# EAGLE design Mixer (EAGLE 9.2.2)
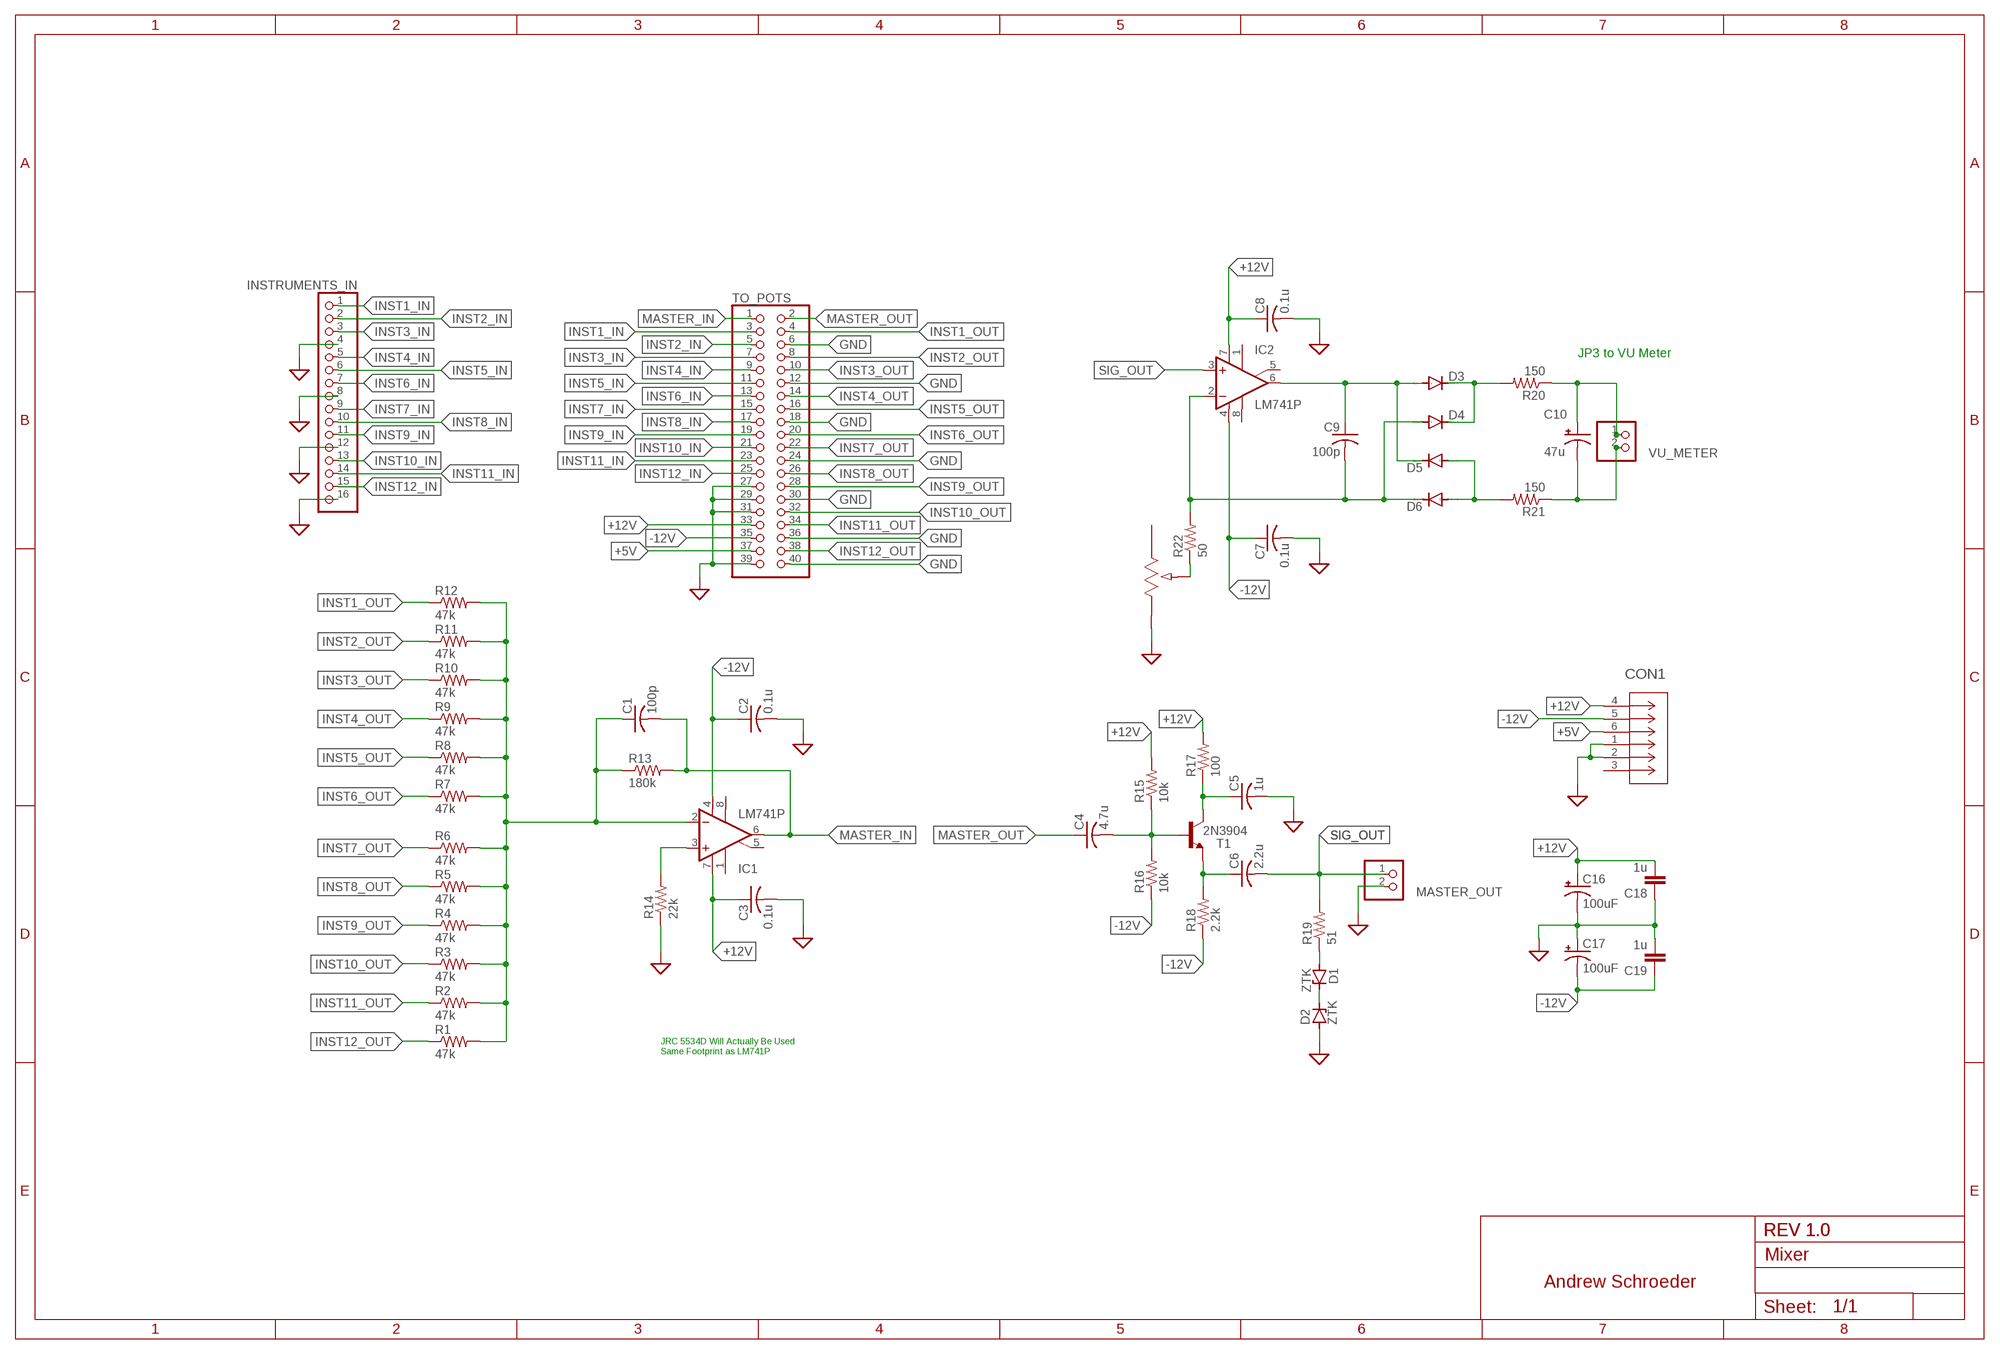
[diagram p0: schematic, sheet 1]

## Parts
C1  100p  C-US025-025X050  [C025-025X050]
C2  0.1u  C-US025-025X050  [C025-025X050]
C3  0.1u  C-US025-025X050  [C025-025X050]
C4  4.7u  C-US025-025X050  [C025-025X050]
C5  1u  C-US025-025X050  [C025-025X050]
C6  2.2u  C-US025-025X050  [C025-025X050]
C7  0.1u  C-US025-025X050  [C025-025X050]
C8  0.1u  C-US025-025X050  [C025-025X050]
C9  100p  C-US025-025X050  [C025-025X050]
C10  47u  CPOL-USE2-5  [E2-5]
C16  100uF  CPOL-USE5-8.5  [E5-8,5]
C17  100uF  CPOL-USE5-8.5  [E5-8,5]
C18  1u  C-EU050-024X044  [C050-024X044]
C19  1u  C-EU050-024X044  [C050-024X044]
CON1  1-770875-01-770875-0_VERTICAL  [1-770875-0]
D1  ZTK  [DO35Z10]
D2  ZTK  [DO35Z10]
D3  1N4148DO35-7  [DO35-7]
D4  1N4148DO35-7  [DO35-7]
D5  1N4148DO35-7  [DO35-7]
D6  1N4148DO35-7  [DO35-7]
IC1  LM741P  [DIL08]
IC2  LM741P  [DIL08]
INSTRUMENTS_IN  PINHD-1X16  [1X16]
MASTER_OUT  PINHD-1X2  [1X02]
R1  47k  R-US_0207/7  [0207/7]
R2  47k  R-US_0207/7  [0207/7]
R3  47k  R-US_0207/7  [0207/7]
R4  47k  R-US_0207/7  [0207/7]
R5  47k  R-US_0207/7  [0207/7]
R6  47k  R-US_0207/7  [0207/7]
R7  47k  R-US_0207/7  [0207/7]
R8  47k  R-US_0207/7  [0207/7]
R9  47k  R-US_0207/7  [0207/7]
R10  47k  R-US_0207/7  [0207/7]
R11  47k  R-US_0207/7  [0207/7]
R12  47k  R-US_0207/7  [0207/7]
R13  180k  R-US_0207/7  [0207/7]
R14  22k  R-US_0207/7  [0207/7]
R15  10k  R-US_0207/7  [0207/7]
R16  10k  R-US_0207/7  [0207/7]
R17  100  R-US_0207/7  [0207/7]
R18  2.2k  R-US_0207/7  [0207/7]
R19  51  R-US_0207/7  [0207/7]
R20  150  R-US_0207/7  [0207/7]
R21  150  R-US_0207/7  [0207/7]
R22  50  R-US_0207/7  [0207/7]
R23  PV36W101C01B00  [POT_PV36W]
T1  2N3904  [TO92]
TO_POTS  PINHD-2X20  [2X20]
VU_METER  PINHD-1X2  [1X02]

## Nets
+5V: CON1.6 TO_POTS.37
+12V: C3.1 C8.1 C16.+ C18.2 CON1.4 IC1.7(V+) IC2.7(V+) R15.2 R17.2 TO_POTS.33
-12V: C2.1 C7.1 C17.- C19.1 CON1.5 IC1.4(V-) IC2.4(V-) R16.1 R18.1 TO_POTS.35
GND: C2.2 C3.2 C5.2 C7.2 C8.2 C16.- C17.+ C18.1 C19.2 CON1.1 CON1.2 D2.A INSTRUMENTS_IN.4 INSTRUMENTS_IN.8 INSTRUMENTS_IN.12 INSTRUMENTS_IN.16 MASTER_OUT.2 R14.1 R23.3 TO_POTS.6 TO_POTS.12 TO_POTS.18 TO_POTS.24 TO_POTS.27 TO_POTS.29 TO_POTS.30 TO_POTS.31 TO_POTS.36 TO_POTS.39 TO_POTS.40 ; supply symbol labelled SUP
INST1_IN: INSTRUMENTS_IN.1 TO_POTS.3
INST1_OUT: R12.1 TO_POTS.4
INST2_IN: INSTRUMENTS_IN.2 TO_POTS.5
INST2_OUT: R11.1 TO_POTS.8
INST3_IN: INSTRUMENTS_IN.3 TO_POTS.7
INST3_OUT: R10.1 TO_POTS.10
INST4_IN: INSTRUMENTS_IN.5 TO_POTS.9
INST4_OUT: R9.1 TO_POTS.14
INST5_IN: INSTRUMENTS_IN.6 TO_POTS.11
INST5_OUT: R8.1 TO_POTS.16
INST6_IN: INSTRUMENTS_IN.7 TO_POTS.13
INST6_OUT: R7.1 TO_POTS.20
INST7_IN: INSTRUMENTS_IN.9 TO_POTS.15
INST7_OUT: R6.1 TO_POTS.22
INST8_IN: INSTRUMENTS_IN.10 TO_POTS.17
INST8_OUT: R5.1 TO_POTS.26
INST9_IN: INSTRUMENTS_IN.11 TO_POTS.19
INST9_OUT: R4.1 TO_POTS.28
INST10_IN: INSTRUMENTS_IN.13 TO_POTS.21
INST10_OUT: R3.1 TO_POTS.32
INST11_IN: INSTRUMENTS_IN.14 TO_POTS.23
INST11_OUT: R2.1 TO_POTS.34
INST12_IN: INSTRUMENTS_IN.15 TO_POTS.25
INST12_OUT: R1.1 TO_POTS.38
MASTER_IN: C1.2 IC1.6(OUT) R13.2 TO_POTS.1
MASTER_OUT: C4.1 TO_POTS.2
N$1: C9.1 D3.A D5.C IC2.6(OUT)
N$2: IC1.3(+IN) R14.2
N$3: C9.2 D4.A D6.C IC2.2(-IN) R22.2
N$4: C1.1 IC1.2(-IN) R1.2 R2.2 R3.2 R4.2 R5.2 R6.2 R7.2 R8.2 R9.2 R10.2 R11.2 R12.2 R13.1
N$5: D5.A D6.A R21.2
N$6: C4.2 R15.1 R16.2 T1.2(B)
N$7: C10.+ R20.1 VU_METER.1
N$8: C5.1 R17.1 T1.1(C)
N$9: D3.C D4.C R20.2
N$10: C6.1 R18.2 T1.3(E)
N$11: C10.- R21.1 VU_METER.2
N$12: D1.A R19.1
N$13: R22.1 R23.2
N$16: D1.C D2.C
SIG_OUT: C6.2 IC2.3(+IN) MASTER_OUT.1 R19.2
Unconnected: CON1.3 IC1.1(ON1) IC1.5(ON2) IC1.8(OPT) IC2.1(ON1) IC2.5(ON2) IC2.8(OPT) R23.1

## Notes on the sheet
- JP3 to VU Meter
- JRC 5534D Will Actually Be Used
  Same Footprint as LM741P
- REV 1.0 | REV 1.0
- Andrew Schroeder

## Library data of the parts
C1-C9 = rcl:C-US: CAPACITOR, American symbol; SPICEPREFIX: C
C10 C16 C17 = rcl:CPOL-US: POLARIZED CAPACITOR, American symbol; SPICEPREFIX: C
C18 C19 = resistor:C-EU: CAPACITOR, European symbol
CON1 = Capstone:1-770875-0
D1 D2 = diode:ZTK: Z DIODE
D3-D6 = diode:1N4148: DIODE high speed (Philips)
IC1 IC2 = linear:*741: OP AMP
INSTRUMENTS_IN = pinhead:PINHD-1X16: PIN HEADER
MASTER_OUT VU_METER = pinhead:PINHD-1X2: PIN HEADER
R1-R22 = rcl:R-US_: RESISTOR, American symbol; SPICEPREFIX: R
R23 = Capstone:PV36W101C01B00; MANUFACTURER_PART_NUMBER: PV36W101C01B00; VENDOR: Murata
T1 = transistor:2N3904: NPN TRANSISTOR
TO_POTS = pinhead:PINHD-2X20: PIN HEADER

## Board
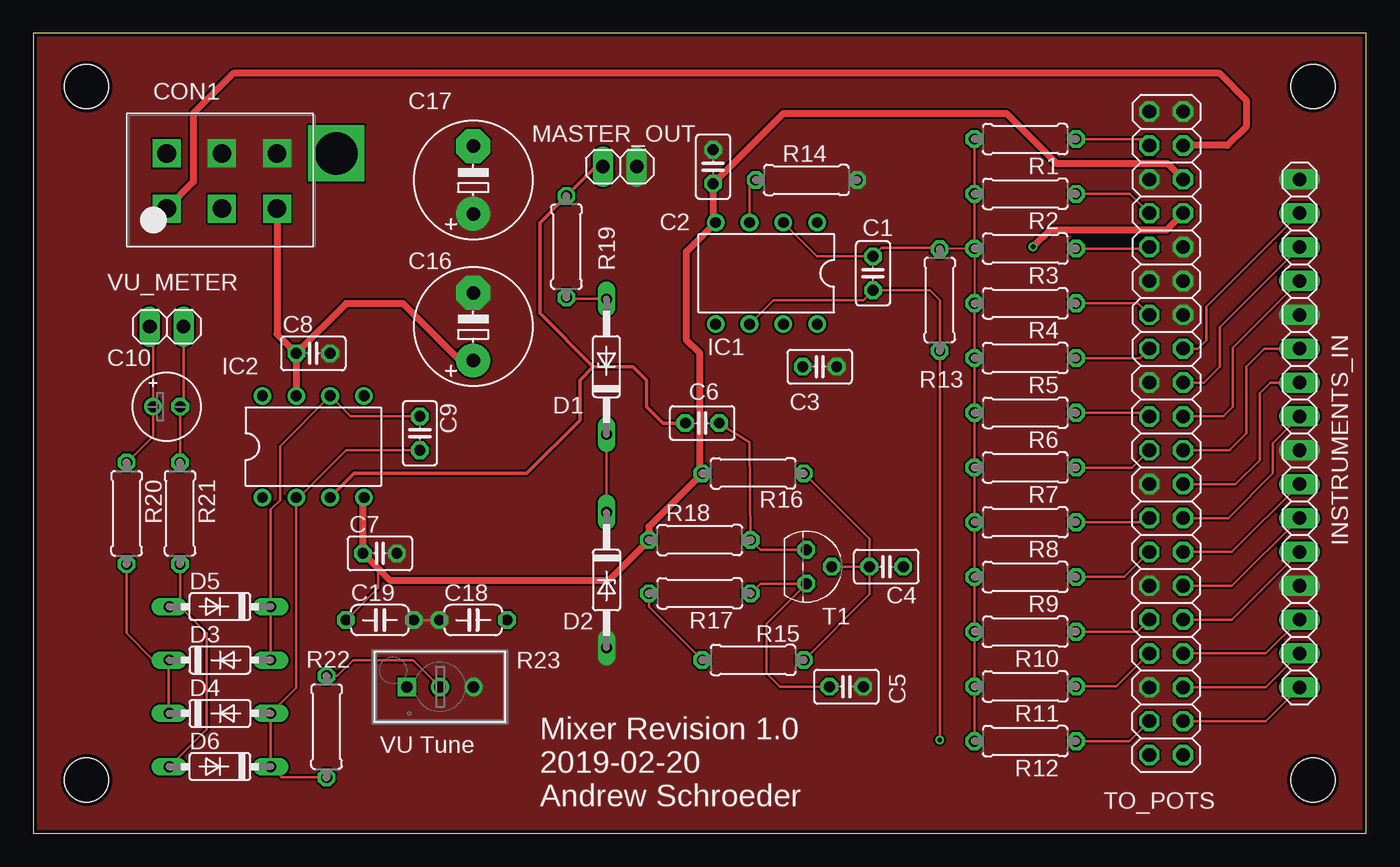
[diagram p1: board, top side]
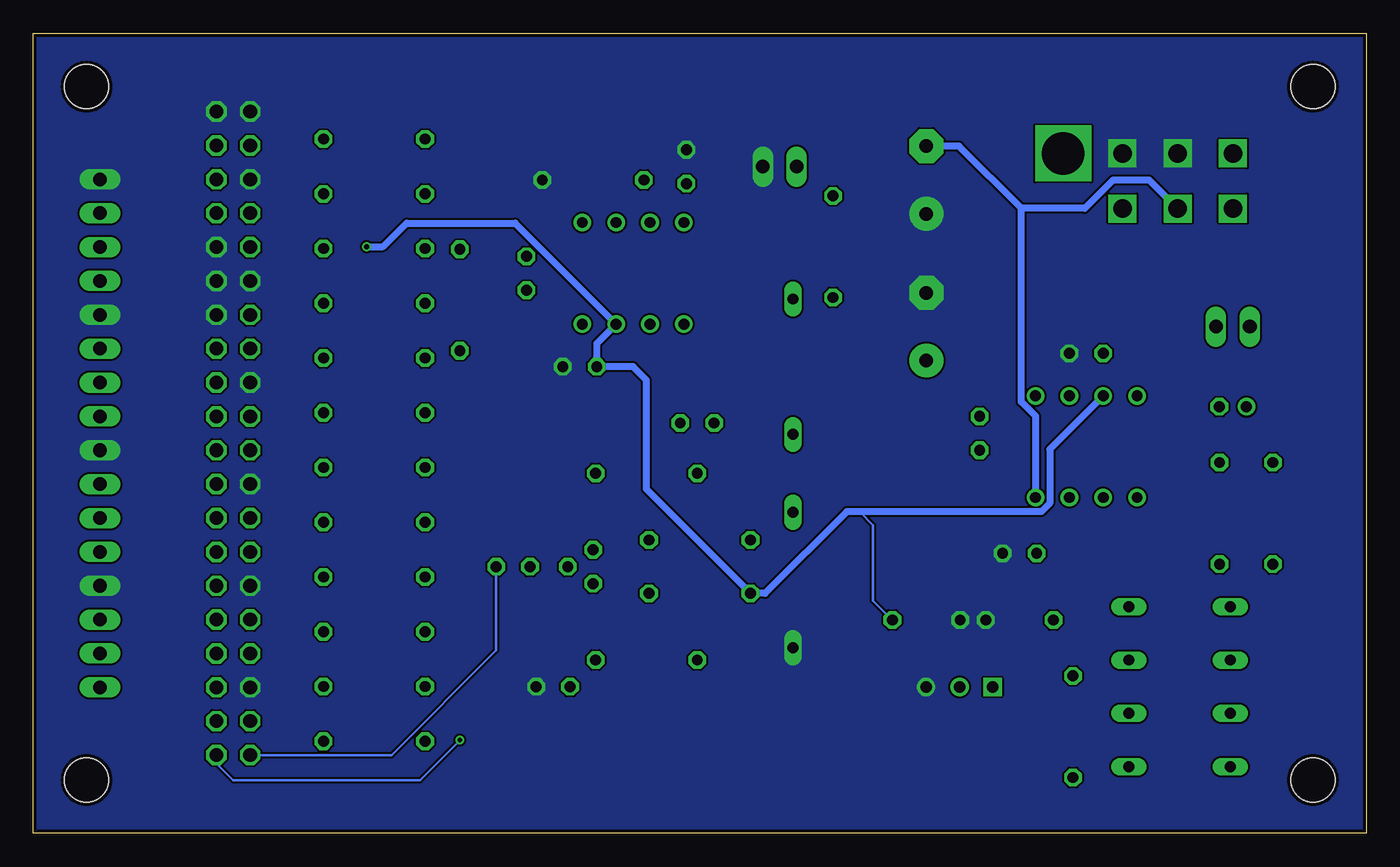
[diagram p2: board, bottom side, seen from below]

Size 100 x 60 mm. Coordinates in mm from the lower left corner, seen from the top.
Outline: 0,0 100,0 100,60 0,60 0,0
Copper layers (1*16): Top 0.035mm / dielectric 1.5mm / Bottom 0.035mm
Design rules "SeeedStudio_2layer_DRU_no_angle_20140221": minimum track width 6mil, minimum drill 12mil, track to track 6mil, track to pad 6mil, pad to pad 6mil, via to via 6mil, smd to smd 0mil, copper to edge 10mil, drill to drill 10mil, minimum pad ring 10mil, minimum via ring 6mil, stop-mask expansion 2mil, vias tented up to drill 100mil, thermal gap 10mil

### Footprints (pad centres in the part's own frame; a part is rotated, then mirrored left to right if it is on the bottom)
C025-025X050 = drill 0.813 octagon: 1 -1.27,0; 2 1.27,0
E2-5 = drill 0.813 pad 1.27: + -1.016,0 | drill 0.813 pad 1.27 octagon: - 1.016,0
E5-8,5 = drill 1.016 pad 2.54: + -2.54,0 | drill 1.016 pad 2.54 octagon: - 2.54,0
C050-024X044 = drill 0.813 octagon: 1 -2.54,0; 2 2.54,0
1-770875-0 = drill 1.4 square: 1 8.28,0; 2 4.14,0; 3 0,0; 4 8.28,-4.14; 5 4.14,-4.14; 6 0,-4.14 | drill 3.18 square: NULL 12.73,0
DO35Z10 = drill 0.813 long: A 5.08,0; C -5.08,0
DO35-7 = drill 0.813 long: A 3.81,0; C -3.81,0
DIL08 = drill 0.813 pad 1.27: 1 -3.81,-3.81; 2 -1.27,-3.81; 3 1.27,-3.81; 4 3.81,-3.81; 5 3.81,3.81; 6 1.27,3.81; 7 -1.27,3.81; 8 -3.81,3.81
1X16 = drill 1.016 long: 1 -19.05,0; 2 -16.51,0; 3 -13.97,0; 4 -11.43,0; 5 -8.89,0; 6 -6.35,0; 7 -3.81,0; 8 -1.27,0; 9 1.27,0; 10 3.81,0; 11 6.35,0; 12 8.89,0; 13 11.43,0; 14 13.97,0; 15 16.51,0; 16 19.05,0
1X02 = drill 1.016 long: 1 -1.27,0; 2 1.27,0
0207/7 = drill 0.813 octagon: 1 -3.81,0; 2 3.81,0
POT_PV36W = drill 0.864 pad 1.372 square: 1 -4.978,-0.025 | drill 0.864 pad 1.372: 2 -2.489,-0.025; 3 0.025,-0.025
TO92 = drill 0.813 octagon: 1 1.27,0; 2 0,1.905; 3 -1.27,0
2X20 = drill 1.016 octagon: 1 -24.13,-1.27; 2 -24.13,1.27; 3 -21.59,-1.27; 4 -21.59,1.27; 5 -19.05,-1.27; 6 -19.05,1.27; 7 -16.51,-1.27; 8 -16.51,1.27; 9 -13.97,-1.27; 10 -13.97,1.27; 11 -11.43,-1.27; 12 -11.43,1.27; 13 -8.89,-1.27; 14 -8.89,1.27; 15 -6.35,-1.27; 16 -6.35,1.27; 17 -3.81,-1.27; 18 -3.81,1.27; 19 -1.27,-1.27; 20 -1.27,1.27; 21 1.27,-1.27; 22 1.27,1.27; 23 3.81,-1.27; 24 3.81,1.27; 25 6.35,-1.27; 26 6.35,1.27; 27 8.89,-1.27; 28 8.89,1.27; 29 11.43,-1.27; 30 11.43,1.27; 31 13.97,-1.27; 32 13.97,1.27; 33 16.51,-1.27; 34 16.51,1.27; 35 19.05,-1.27; 36 19.05,1.27; 37 21.59,-1.27; 38 21.59,1.27; 39 24.13,-1.27; 40 24.13,1.27
STAND-OFF = hole 3.302: 0,0

### Placement (x,y rotation side)
C1  63,42 270 top
C2  51,50 90 top
C3  59,35 0 top
C4  64,20 180 top
C5  61,11 0 top
C6  50.19,30.77 180 top
C7  26,21 0 top
C8  21,36 0 top
C9  29,30 270 top
C10  10,32 0 top
C16  33,38 90 top
C17  33,49 90 top
C18  33,16 0 top
C19  26,16 0 top
CON1  10,51 0 top
D1  43,35 90 top
D2  43,19 270 top
D3  14,13 0 top
D4  14,9 0 top
D5  14,17 180 top
D6  14,5 180 top
IC1  55,42 180 top
IC2  21,29 0 top
INSTRUMENTS_IN  95,30 90 top
MASTER_OUT  44,50 0 top
R1  74.42,52.07 180 top
R2  74.42,47.96 180 top
R3  74.42,43.86 180 top
R4  74.42,39.75 180 top
R5  74.42,35.65 180 top
R6  74.42,31.54 180 top
R7  74.42,27.44 180 top
R8  74.42,23.33 180 top
R9  74.42,19.23 180 top
R10  74.42,15.12 180 top
R11  74.42,11.02 180 top
R12  74.42,6.91 180 top
R13  68,40 270 top
R14  58,49 180 top
R15  54,13 180 top
R16  54,27 0 top
R17  50,18 180 top
R18  50,22 0 top
R19  40,44 90 top
R20  7,24 270 top
R21  11,24 270 top
R22  22,8 270 top
R23  33,11 0 top
T1  58,20 270 top
TO_POTS  85,30 90 top
U$1  [STAND-OFF]  4,4 0 top
U$2  [STAND-OFF]  96,56 0 top
U$3  [STAND-OFF]  4,56 0 top
U$4  [STAND-OFF]  96,4 0 top
U$5  [A5L-LOC]  -48,-38 0 top  (outside the outline)
VU_METER  10,38 0 top

### Tracks (layer width: path | path; a pad name or v marks a point on that pad's centre or on a via)
+5V
  Top 0.508: TO_POTS.37 89.59,51.59 91,53 91,55 89,57 15,57 12,54 12,48.86 CON1.6
+12V  (via drill 0.35)
  Top 0.2: R15.2 46.19,17 R17.2
  Top 0.508: TO_POTS.33 85.01,45.25 76.25,45.25 v75,44 | C8.1 IC2.7 | C16.+ 32,35.46 27.73,39.73 23.46,39.73 C8.1 | CON1.4 18.28,37.45 C8.1
  Bottom 0.2: 38,24.12 37,23.12 37,17.46 C18.2
  Bottom 0.508: v75,44 73.76,44 71.99,45.77 63.85,45.77 IC1.7 57.73,36.73 C3.1 55,35 54,34 54,25.81 R17.2 45.09,18 38.97,24.12 38,24.12 24.37,24.12 23.74,24.75 23.74,28.8 IC2.7
-12V
  Top 0.2: 51,46 IC1.4 | 25.86,19.86 25.86,18.41 C19.1
  Top 0.508: 51,46 C2.1 56.27,54 73,54 76.75,50.25 85.07,50.25 TO_POTS.35 | IC2.4 24.73,25.11 C7.1 25.86,19.86 26.73,19 43.19,19 R18.1 46.19,23 R16.1 50,27.19 50,36 49,37 49,43.62 IC1.4
  Bottom 0.508: IC2.4 24.81,31.3 25.88,32.37 25.88,46.88 | C17.- 30.54,51.54 25.88,46.88 | CON1.5 16.28,49 19,49 21.12,46.88 25.88,46.88
GND
  Top 0.2: C18.1 C19.2
  pour Bottom (no thermals): -1,61 101,61 101,-1 -1,-1
  pour Top (no thermals): -2,62 102,62 102,-2 -2,-2
INST1_IN
  Top 0.2: INSTRUMENTS_IN.1 92.46,8.41 TO_POTS.3
INST1_OUT
  Top 0.2: R12.1 82.23,6.91 TO_POTS.4
INST2_IN
  Top 0.2: INSTRUMENTS_IN.2 92.46,10.95 TO_POTS.5
INST2_OUT
  Top 0.2: R11.1 81.25,11.02 TO_POTS.8
INST3_IN
  Top 0.2: INSTRUMENTS_IN.3 92.46,13.49 TO_POTS.7
INST3_OUT
  Top 0.2: R10.1 82.82,15.12 TO_POTS.10
INST4_IN
  Top 0.2: INSTRUMENTS_IN.5 89.92,16.03 TO_POTS.9
INST4_OUT
  Top 0.2: R9.1 81.85,19.23 TO_POTS.14
INST5_IN
  Top 0.2: INSTRUMENTS_IN.6 89.92,18.57 TO_POTS.11
INST5_OUT
  Top 0.2: R8.1 83.41,23.33 TO_POTS.16
INST6_IN
  Top 0.2: INSTRUMENTS_IN.7 89.92,21.11 TO_POTS.13
INST6_OUT
  Top 0.2: R7.1 82.44,27.44 TO_POTS.20
INST7_IN
  Top 0.2: TO_POTS.15 89.65,23.65 93,27 93,29.27 INSTRUMENTS_IN.9
INST7_OUT
  Top 0.2: R6.1 83.46,31.54 TO_POTS.22
INST8_IN
  Top 0.2: INSTRUMENTS_IN.10 92.81,33.81 92,33 92,28 90.19,26.19 TO_POTS.17
INST8_OUT
  Top 0.2: R5.1 83.03,35.65 TO_POTS.26
INST9_IN
  Top 0.2: TO_POTS.19 89.73,28.73 91,30 91,35 92.35,36.35 INSTRUMENTS_IN.11
INST9_OUT
  Top 0.2: R4.1 82.87,39.75 TO_POTS.28
INST10_IN
  Top 0.2: INSTRUMENTS_IN.13 90,36.43 90,32 89.27,31.27 TO_POTS.21
INST10_OUT
  Top 0.2: R3.1 83.62,43.86 TO_POTS.32
INST11_IN
  Top 0.2: INSTRUMENTS_IN.14 89,37.97 89,35 87.81,33.81 TO_POTS.23
INST11_OUT
  Top 0.2: R2.1 82.28,47.97 TO_POTS.34
INST12_IN
  Top 0.2: INSTRUMENTS_IN.15 88,39.51 88,37 87.35,36.35 TO_POTS.25
INST12_OUT
  Top 0.2: R1.1 83.25,52.07 TO_POTS.38
MASTER_IN  (via drill 0.35)
  Top 0.2: IC1.6 55.54,40 62.27,40 C1.2 67.27,40.73 68,40 R13.2 68,36 v68,7
  Bottom 0.2: v68,7 71,4 85,4 86.27,5.27 TO_POTS.1
MASTER_OUT
  Bottom 0.2: TO_POTS.2 73.13,5.87 65.27,13.73 C4.1
N$1
  Top 0.2: D3.A D5.C 17.81,24.31 18.5,25 18.5,29.04 IC2.6 23.81,31.27 C9.1
N$2
  Top 0.2: R14.2 53.73,48.54 IC1.3
N$3
  Top 0.2: 19.73,25 19.73,10.92 D4.A D6.C 18.62,4.19 R22.2 | 19.73,25 IC2.2 | C9.2 23.46,28.73 19.73,25
N$4
  Top 0.152: R4.2 R3.2 67.95,43.86 67.91,43.91
  Top 0.2: R1.2 R2.2 R3.2 | R4.2 R5.2 R6.2 R7.2 R8.2 R9.2 R10.2 R11.2 R12.2 | R13.1 67.91,43.91 63.63,43.91 C1.1 58.81,43.27 IC1.2
N$5
  Top 0.2: R21.2 11,17.09 D5.A 11,17 13,15 13,7.81 D6.A
N$6
  Top 0.2: C4.2 62.73,22.08 R16.2 | C4.2 62.73,17.92 R15.1 | C4.2 T1.2
N$7
  Top 0.2: VU_METER.1 8.98,37.75 C10.+ 8.98,29.79 R20.1
N$8
  Top 0.2: R17.1 54.54,18.73 T1.1 55,15.73 55,12 56,11 C5.1
N$9
  Top 0.2: D3.C 10.15,13.08 10.15,13 | D4.C 10.15,9.04 10.15,13 | 10.15,13 9,13 7,15 R20.2
N$10
  Top 0.2: T1.3 54.54,21.27 R18.2 53.75,29.35 C6.1
N$11
  Top 0.2: VU_METER.2 11.27,32.25 C10.- 11.02,27.83 R21.1
N$12
  Top 0.2: D1.A 40.11,40.08 R19.1
N$13
  Top 0.2: R22.1 22.81,11.81 24,13 28.48,13 R23.2
N$16
  Top 0.2: D1.C D2.C
SIG_OUT
  Top 0.254: IC2.3 24.08,27 37,27 41,31 41,34 42,35 | 42,35 45,35 46,34 46,32 47.23,30.77 C6.2 | 42,35 38,39 38,45.81 R19.2 42.19,50 MASTER_OUT.1

### Text on the board
tNames: VU Tune | Mixer Revision 1.0 / 2019-02-20 / Andrew Schroeder
Document: Revision 1.0 | Andrew Schroeder